# Altium project Christmas-2023_Soundboard.PrjPcb
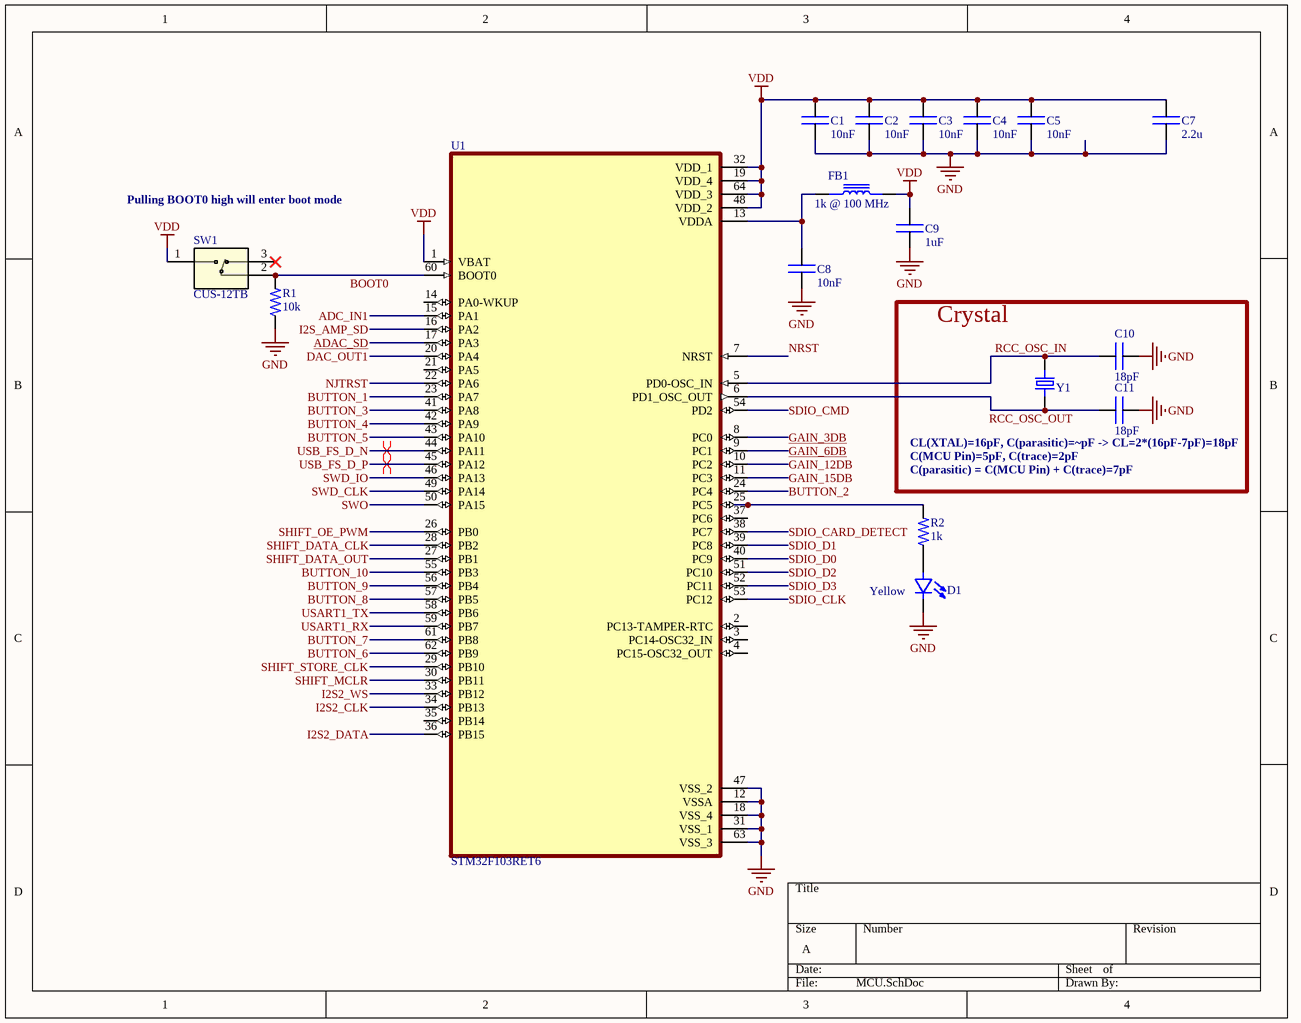
[diagram p0: MCU.SchDoc]
5 sheets, 208 parts. Net scope: global (net labels, ports and power ports of the same name join across sheets).
Board file: Christmas-2023_Soundboard.PcbDoc
Sheets:
  MCU.SchDoc
  Connectors-SD.SchDoc
  Amplifier.SchDoc
  PWR.SchDoc
  UI.SchDoc

## Sheet MCU.SchDoc
size A; SheetNumber: 1; SheetTotal: 5

### Parts
C1  value 10nF  [0603-CAP]  (hidden comment: CAP)
C2  value 10nF  [0603-CAP]  (hidden comment: CAP)
C3  value 10nF  [0603-CAP]  (hidden comment: CAP)
C4  value 10nF  [0603-CAP]  (hidden comment: CAP)
C5  value 10nF  [0603-CAP]  (hidden comment: CAP)
C7  value 2.2u  [0603-CAP]  (hidden comment: CAP)
C8  value 10nF  [0603-CAP]  (hidden comment: CAP)
C9  value 1uF  [0603-CAP]  (hidden comment: CAP)
C10  value 18pF  [0603-CAP]  (hidden comment: CAP)
C11  value 18pF  [0603-CAP]  (hidden comment: CAP)
D1  Color: Yellow  [0603-LED]  (hidden comment: LED - single)
FB1  1k @ 100 MHz  [0603-FB]
R1  value 10k  [0603-RES]  (hidden comment: RES)
R2  value 1k  [0603-RES]  (hidden comment: RES)
SW1  CUS-12TB  [SSSS811101]
U1  STM32F103RET6  [LQFP-64]
Y1  SX5B12.000F1620F30  [SMD5032-4P]  (value not drawn)

### Blocks framed on the sheet
Crystal: C10 C11 Y1

### Nets
GND: C1.1 C2.1 C3.1 C4.1 C5.1 C7.1 C8.1 C9.1 C10.2 C11.2 D1.2(C) R1.1 U1.12(VSSA) U1.18(VSS_4) U1.31(VSS_1) U1.47(VSS_2) U1.63(VSS_3)
VDD: C1.2 C2.2 C3.2 C4.2 C5.2 C7.2 C9.2 FB1.2 SW1.1 U1.1(VBAT) U1.19(VDD_4) U1.32(VDD_1) U1.48(VDD_2) U1.64(VDD_3)
ADAC_SD: U1.17(PA3)
ADC_IN1: U1.15(PA1)
BOOT0: R1.2 SW1.2 U1.60(BOOT0)
BUTTON_1: U1.23(PA7)
BUTTON_2: U1.24(PC4)
BUTTON_3: U1.41(PA8)
BUTTON_4: U1.42(PA9)
BUTTON_5: U1.43(PA10)
BUTTON_6: U1.62(PB9)
BUTTON_7: U1.61(PB8)
BUTTON_8: U1.57(PB5)
BUTTON_9: U1.56(PB4)
BUTTON_10: U1.55(PB3)
DAC_OUT1: U1.20(PA4)
GAIN_3DB: U1.8(PC0)
GAIN_6DB: U1.9(PC1)
GAIN_12DB: U1.10(PC2)
GAIN_15DB: U1.11(PC3)
I2S2_CLK: U1.34(PB13)
I2S2_DATA: U1.36(PB15)
I2S2_WS: U1.33(PB12)
I2S_AMP_SD: U1.16(PA2)
NJTRST: U1.22(PA6)
NRST: U1.7(NRST)
RCC_OSC_IN: C10.1 U1.5(PD0-OSC_IN) Y1.1
RCC_OSC_OUT: C11.1 U1.6(PD1_OSC_OUT) Y1.2
SDIO_CARD_DETECT: U1.38(PC7)
SDIO_CLK: U1.53(PC12)
SDIO_CMD: U1.54(PD2)
SDIO_D0: U1.40(PC9)
SDIO_D1: U1.39(PC8)
SDIO_D2: U1.51(PC10)
SDIO_D3: U1.52(PC11)
SHIFT_DATA_CLK: U1.28(PB2)
SHIFT_DATA_OUT: U1.27(PB1)
SHIFT_MCLR: U1.30(PB11)
SHIFT_OE_PWM: U1.26(PB0)
SHIFT_STORE_CLK: U1.29(PB10)
SWD_CLK: U1.49(PA14)
SWD_IO: U1.46(PA13)
SWO: U1.50(PA15)
USART1_RX: U1.59(PB7)
USART1_TX: U1.58(PB6)
USB_FS_D_N: U1.44(PA11)
USB_FS_D_P: U1.45(PA12)
NetC8_2: C8.2 FB1.1 U1.13(VDDA)
NetD1_1: D1.1(A) R2.1
NetR2_2: R2.2 U1.25(PC5)

Not connected (* = marked no-connect by the designer): SW1 3*; U1 2(PC13-TAMPER-RTC) 3(PC14-OSC32_IN) 4(PC15-OSC32_OUT) 14(PA0-WKUP) 21(PA5) 35(PB14) 37(PC6)

### Layout directives
differential pair; differential pair class DIFF_USB: USB_FS_D_N, USB_FS_D_P

### Notes on the sheet
- Pulling BOOT0 high will enter boot mode
- CL(XTAL)=16pF, C(parasitic)=~pF -> CL=2*(16pF-7pF)=18pF
- C(MCU Pin)=5pF, C(trace)=2pF
- C(parasitic) = C(MCU Pin) + C(trace)=7pF

### Library data of the parts
C1-C5 C7-C11 = CAP: Capaicitor; Type: SMD; MFR: *; MFR PN: *
D1 = LED - single: LED; MFR: MEIHUA; MFR PN: MHT192WDT-GOLD; Type: SMD
FB1 = FERRITE BEAD: MFR: TDK; MFR PN: MMZ1608Y102BTD25; Type: SMD
R1 R2 = RES: Resistor; MFR PN: *; MFR: *; Type: SMD
SW1 = SPDT SLIDE SWITCH: JLC Alternate: / SSSS811101; MFR: ALPSALPINE; MFR PN: SSSS811101; Type: SMD
U1 = STM32F103RET6: STM32F103RET6, 32 bit ARM Cortex M3 Microcontroller 72MHz 256 kB Flash, 48 kB RAM, USB CAN I2C 64-Pin LQFP; MFR: STMicroelectronics; MFR PN: STM32F103RET6; Type: SMD
Y1 = XTAL-OSC_JLC: SMD Tuning Fork Crystal; MFR: Shenzhen SCTF Elec; Frequency: 12MHz; MFR PN: SX5B12.000F1620F30; Type: SMD; JLC PN: C2901628

## Sheet Connectors-SD.SchDoc
size B; SheetNumber: 2; SheetTotal: 5
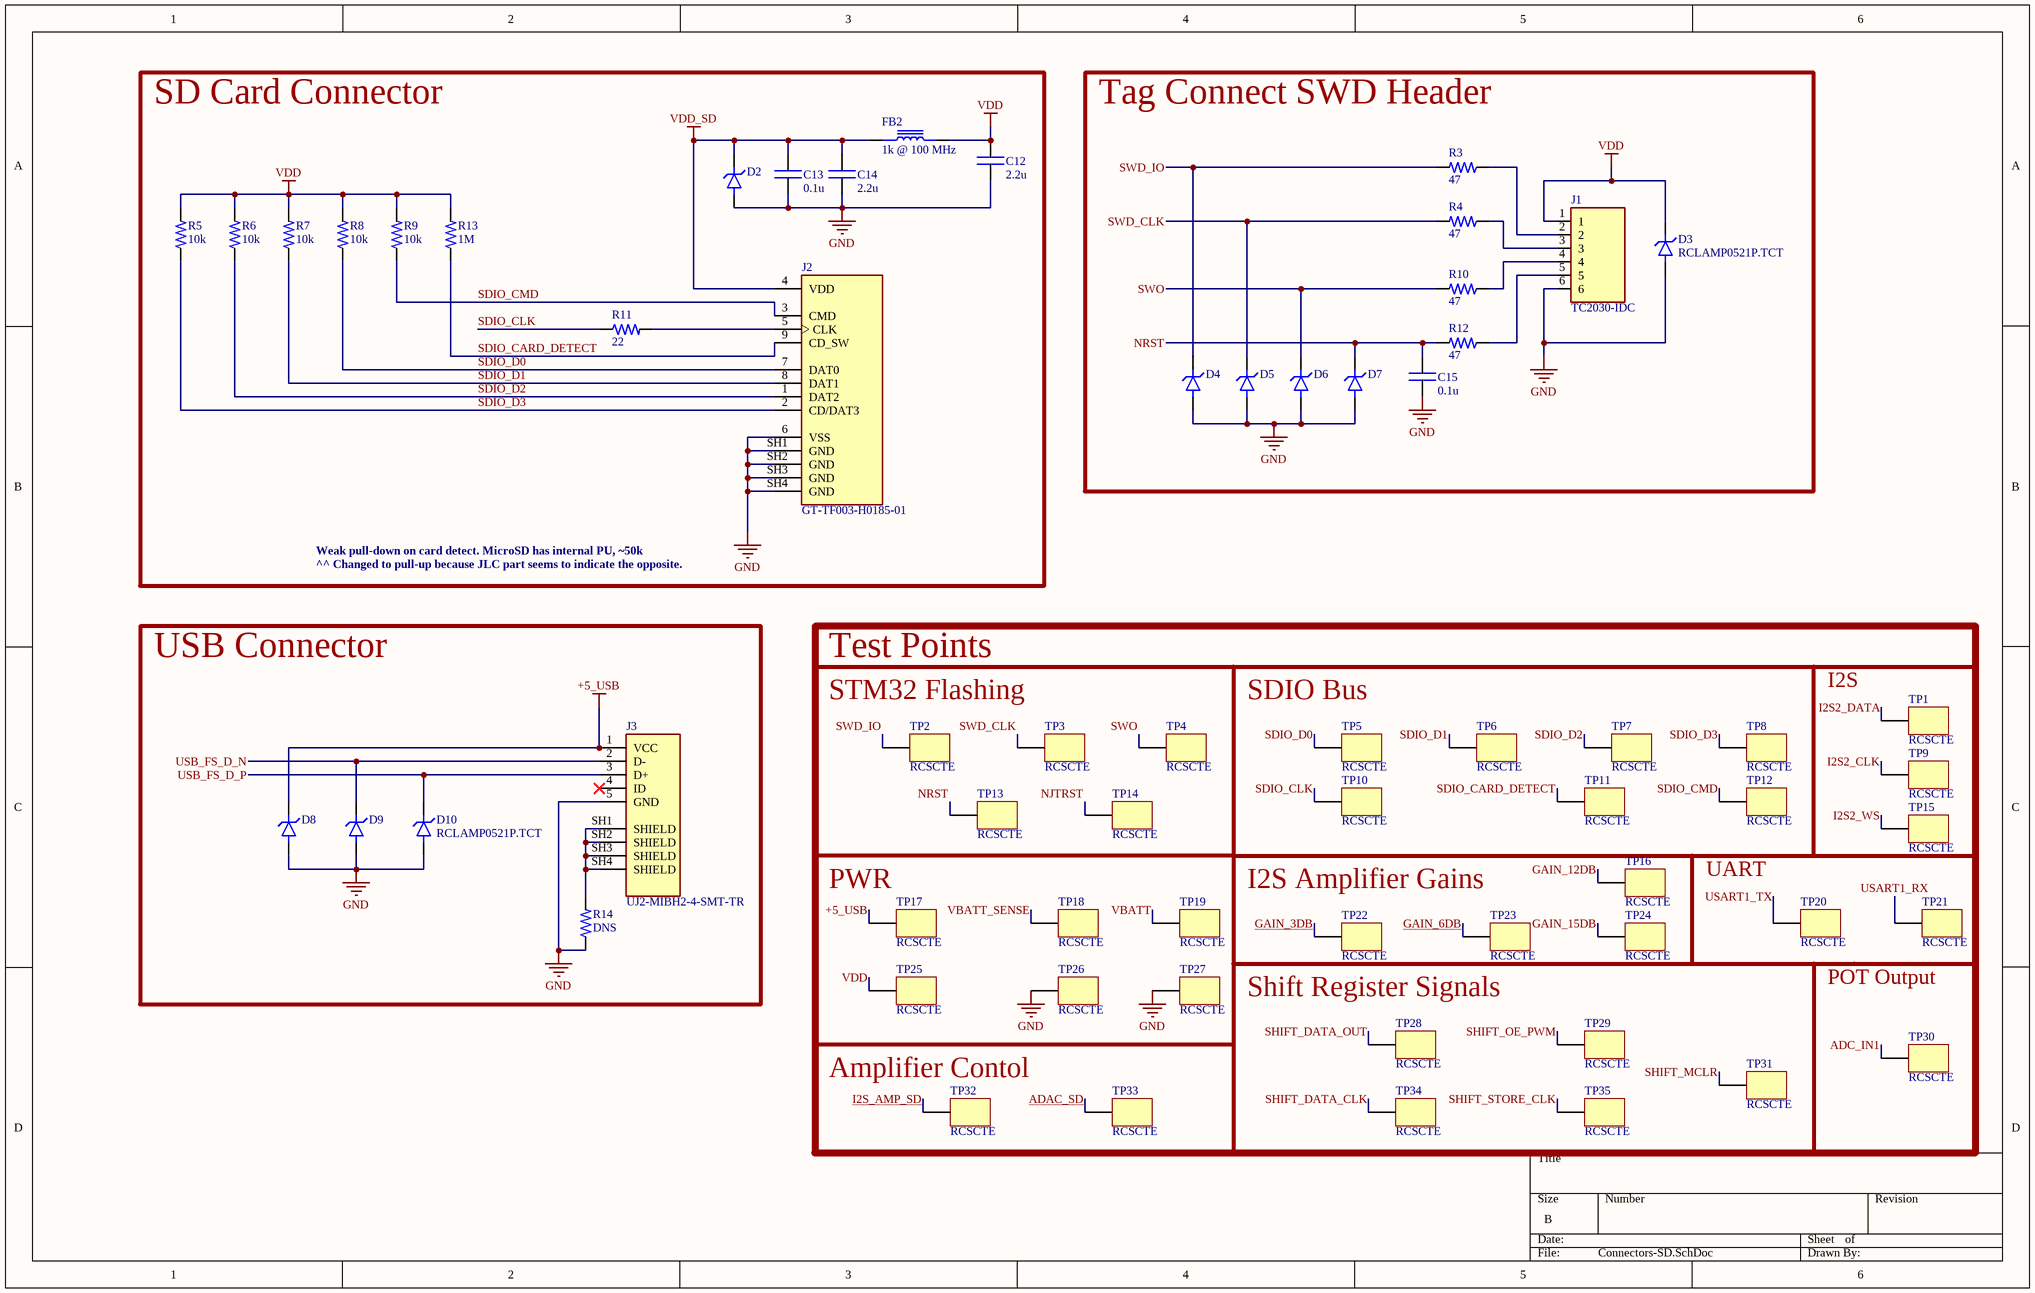
[diagram p1: Connectors-SD.SchDoc]

### Parts
C12  value 2.2u  [0603-CAP]  (hidden comment: CAP)
C13  value 0.1u  [0603-CAP]  (hidden comment: CAP)
C14  value 2.2u  [0603-CAP]  (hidden comment: CAP)
C15  value 0.1u  [0603-CAP]  (hidden comment: CAP)
D2  RCLAMP0521P.TCT  [RCLAMP0521P.TCT]  (value not drawn)
D3  RCLAMP0521P.TCT  [RCLAMP0521P.TCT]
D4  RCLAMP0521P.TCT  [RCLAMP0521P.TCT]  (value not drawn)
D5  RCLAMP0521P.TCT  [RCLAMP0521P.TCT]  (value not drawn)
D6  RCLAMP0521P.TCT  [RCLAMP0521P.TCT]  (value not drawn)
D7  RCLAMP0521P.TCT  [RCLAMP0521P.TCT]  (value not drawn)
D8  RCLAMP0521P.TCT  [RCLAMP0521P.TCT]  (value not drawn)
D9  RCLAMP0521P.TCT  [RCLAMP0521P.TCT]  (value not drawn)
D10  RCLAMP0521P.TCT  [RCLAMP0521P.TCT]
FB2  1k @ 100 MHz  [0603-FB]
J1  TC2030-IDC  [TAG CONNECT TC2030IDC - NO 3D MODEL]
J2  GT-TF003-H0185-01  [GTTF003H018501]
J3  UJ2-MIBH2-4-SMT-TR  [USB MICRO JLC]
R3  value 47  [0603-RES]  (hidden comment: RES)
R4  value 47  [0603-RES]  (hidden comment: RES)
R5  value 10k  [0603-RES]  (hidden comment: RES)
R6  value 10k  [0603-RES]  (hidden comment: RES)
R7  value 10k  [0603-RES]  (hidden comment: RES)
R8  value 10k  [0603-RES]  (hidden comment: RES)
R9  value 10k  [0603-RES]  (hidden comment: RES)
R10  value 47  [0603-RES]  (hidden comment: RES)
R11  value 22  [0603-RES]  (hidden comment: RES)
R12  value 47  [0603-RES]  (hidden comment: RES)
R13  value 1M  [0603-RES]  (hidden comment: RES)
R14  value DNS  [0603-RES]  (hidden comment: RES)
TP1  RCSCTE  [RCWCTE]
TP2  RCSCTE  [RCWCTE]
TP3  RCSCTE  [RCWCTE]
TP4  RCSCTE  [RCWCTE]
TP5  RCSCTE  [RCWCTE]
TP6  RCSCTE  [RCWCTE]
TP7  RCSCTE  [RCWCTE]
TP8  RCSCTE  [RCWCTE]
TP9  RCSCTE  [RCWCTE]
TP10  RCSCTE  [RCWCTE]
TP11  RCSCTE  [RCWCTE]
TP12  RCSCTE  [RCWCTE]
TP13  RCSCTE  [RCWCTE]
TP14  RCSCTE  [RCWCTE]
TP15  RCSCTE  [RCWCTE]
TP16  RCSCTE  [RCWCTE]
TP17  RCSCTE  [RCWCTE]
TP18  RCSCTE  [RCWCTE]
TP19  RCSCTE  [RCWCTE]
TP20  RCSCTE  [RCWCTE]
TP21  RCSCTE  [RCWCTE]
TP22  RCSCTE  [RCWCTE]
TP23  RCSCTE  [RCWCTE]
TP24  RCSCTE  [RCWCTE]
TP25  RCSCTE  [RCWCTE]
TP26  RCSCTE  [RCWCTE]
TP27  RCSCTE  [RCWCTE]
TP28  RCSCTE  [RCWCTE]
TP29  RCSCTE  [RCWCTE]
TP30  RCSCTE  [RCWCTE]
TP31  RCSCTE  [RCWCTE]
TP32  RCSCTE  [RCWCTE]
TP33  RCSCTE  [RCWCTE]
TP34  RCSCTE  [RCWCTE]
TP35  RCSCTE  [RCWCTE]

### Blocks framed on the sheet
SD Card Connector: C12-C14 D2 FB2 J2 R5-R9 R11 R13
Tag Connect SWD Header: C15 D3-D7 J1 R3 R4 R10 R12
USB Connector: D8-D10 J3 R14
Test Points: TP1-TP35

### Nets
+5_USB: D8.K J3.1(VCC) TP17.1
GND: C12.1 C13.1 C14.1 C15.1 D2.A D3.A D4.A D5.A D6.A D7.A D8.A D9.A D10.A J1.6 J2.6(VSS) J2.SH1(GND) J2.SH2(GND) J2.SH3(GND) J2.SH4(GND) J3.5(GND) R14.1 TP26.1 TP27.1
VBATT: TP19.1
VDD: C12.2 D3.K FB2.2 J1.1 R5.2 R6.2 R7.2 R8.2 R9.2 R13.2 TP25.1
VDD_SD: C13.2 C14.2 D2.K FB2.1 J2.4(VDD)
ADAC_SD: TP33.1
ADC_IN1: TP30.1
GAIN_3DB: TP22.1
GAIN_6DB: TP23.1
GAIN_12DB: TP16.1
GAIN_15DB: TP24.1
I2S2_CLK: TP9.1
I2S2_DATA: TP1.1
I2S2_WS: TP15.1
I2S_AMP_SD: TP32.1
NJTRST: TP14.1
NRST: C15.2 D7.K R12.2 TP13.1
SDIO_CARD_DETECT: J2.9(CD_SW) R13.1 TP11.1
SDIO_CLK: R11.1 TP10.1
SDIO_CMD: J2.3(CMD) R9.1 TP12.1
SDIO_D0: J2.7(DAT0) R8.1 TP5.1
SDIO_D1: J2.8(DAT1) R7.1 TP6.1
SDIO_D2: J2.1(DAT2) R6.1 TP7.1
SDIO_D3: J2.2(CD/DAT3) R5.1 TP8.1
SHIFT_DATA_CLK: TP34.1
SHIFT_DATA_OUT: TP28.1
SHIFT_MCLR: TP31.1
SHIFT_OE_PWM: TP29.1
SHIFT_STORE_CLK: TP35.1
SWD_CLK: D5.K R4.2 TP3.1
SWD_IO: D4.K R3.2 TP2.1
SWO: D6.K R10.2 TP4.1
USART1_RX: TP21.1
USART1_TX: TP20.1
USB_FS_D_N: D9.K J3.2(D-)
USB_FS_D_P: D10.K J3.3(D+)
VBATT_SENSE: TP18.1
NetJ1_2: J1.2 R3.1
NetJ1_3: J1.3 R4.1
NetJ1_4: J1.4 R10.1
NetJ1_5: J1.5 R12.1
NetJ2_5: J2.5(CLK) R11.2
NetJ3_SH1: J3.SH1(SHIELD) J3.SH2(SHIELD) J3.SH3(SHIELD) J3.SH4(SHIELD) R14.2

Not connected (* = marked no-connect by the designer): J3 4(ID)*

### Notes on the sheet
- Weak pull-down on card detect. MicroSD has internal PU, ~50k
- ^^ Changed to pull-up because JLC part seems to indicate the opposite.
- STM32 Flashing
- (near TP5) SDIO Bus
- I2S
- (near TP17) PWR
- I2S Amplifier Gains
- UART
- Shift Register Signals
- POT Output
- (near TP32) Amplifier Contol

### Library data of the parts
C12-C15 = CAP: Capaicitor; Type: SMD; MFR: *; MFR PN: *
D2-D10 = TVS DIODE: 25V Clamp 4A (8/20µs) Ipp Tvs Diode Surface Mount SLP1006P2; MFR: Semtech Corporation; Type: SMD; MFR PN: RCLAMP0521P.TCT
FB2 = FERRITE BEAD: as FB1 on sheet MCU
J1 = TAG CONNECT POGO HEADER: "Plug of Nails" POGO Pin connector; MFR: Tag-Connect; MFR PN: TC2030-IDC
J2 = SD-CONN-SMD_JLC: MFR: G-Switch; MFR PN: GT-TF003-H0185-01; Type: SMD
J3 = Micro USB Port: Micro B, USB 2.0, 1.8 A, Right Angle, Surface Mount (SMT), USB Receptacle; MFR: D-CHAIN; MFR PN: UA0507065250-037-06
R3-R14 = RES: Resistor; MFR PN: *; MFR: *; Type: SMD
TP1-TP35 = Test Point: Test Point, Surface Mount; MFR: KOA Speer Electronics, Inc.; MFR PN: RCSCTE; Type: SMD

## Sheet Amplifier.SchDoc
size A; SheetNumber: 3; SheetTotal: 5
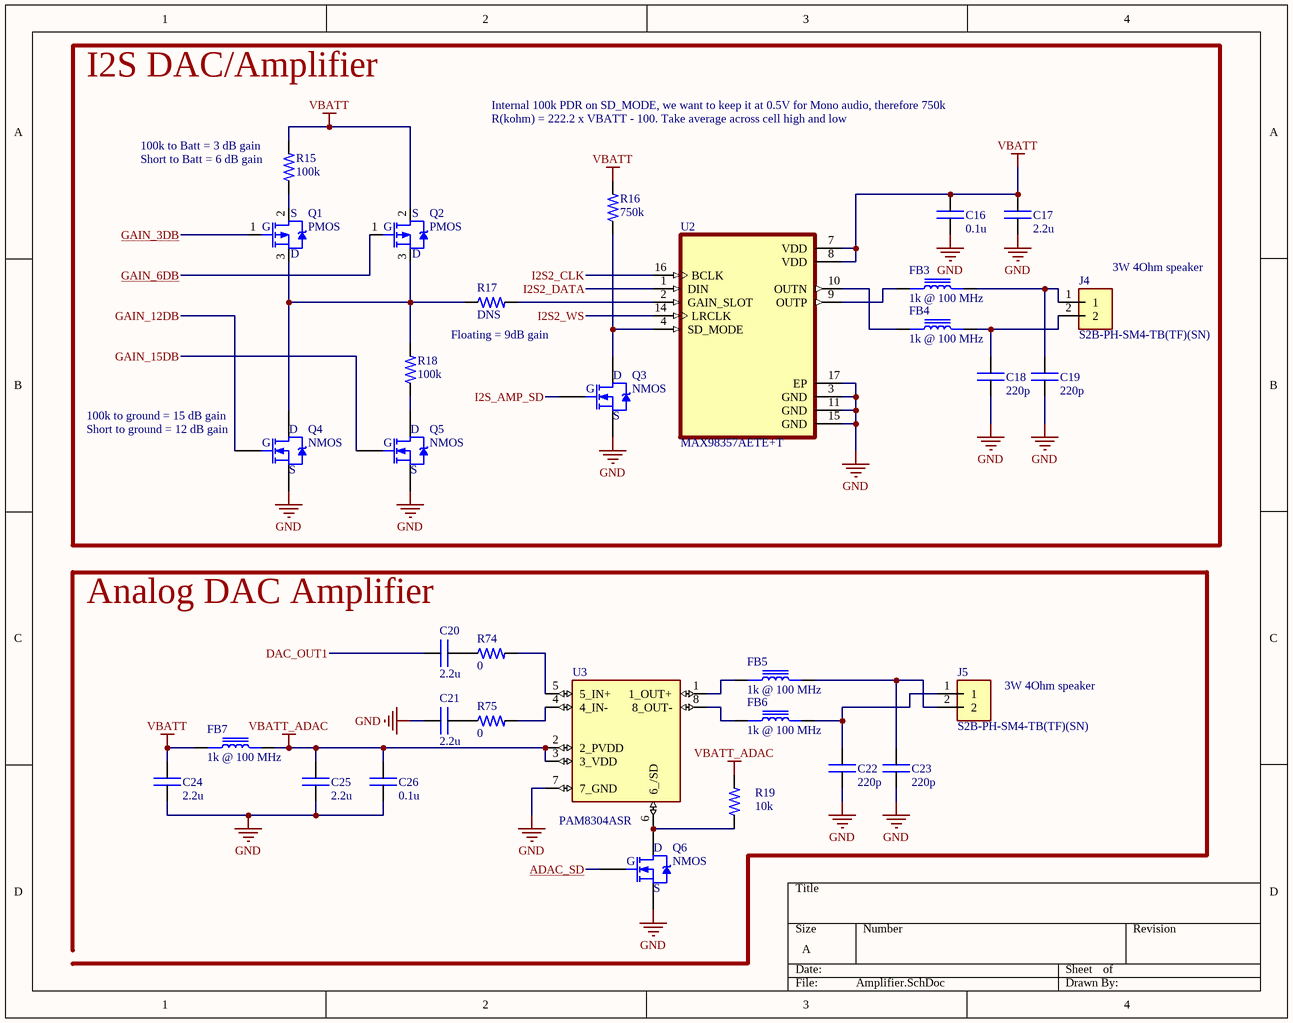
[diagram p2: Amplifier.SchDoc]

### Parts
C16  value 0.1u  [0603-CAP]  (hidden comment: CAP)
C17  value 2.2u  [0603-CAP]  (hidden comment: CAP)
C18  value 220p  [0603-CAP]  (hidden comment: CAP)
C19  value 220p  [0603-CAP]  (hidden comment: CAP)
C20  value 2.2u  [0603-CAP]  (hidden comment: CAP)
C21  value 2.2u  [0603-CAP]  (hidden comment: CAP)
C22  value 220p  [0603-CAP]  (hidden comment: CAP)
C23  value 220p  [0603-CAP]  (hidden comment: CAP)
C24  value 2.2u  [0603-CAP]  (hidden comment: CAP)
C25  value 2.2u  [0603-CAP]  (hidden comment: CAP)
C26  value 0.1u  [0603-CAP]  (hidden comment: CAP)
FB3  1k @ 100 MHz  [0603-FB]
FB4  1k @ 100 MHz  [0603-FB]
FB5  1k @ 100 MHz  [0603-FB]
FB6  1k @ 100 MHz  [0603-FB]
FB7  1k @ 100 MHz  [0603-FB]
J4  S2B-PH-SM4-TB(TF)(SN)  [JST_PH-2POS-SMT-RA]
J5  S2B-PH-SM4-TB(TF)(SN)  [JST_PH-2POS-SMT-RA]
Q1  PMOS  [SOT-23]
Q2  PMOS  [SOT-23]
Q3  NMOS  [SOT-23]
Q4  NMOS  [SOT-23]
Q5  NMOS  [SOT-23]
Q6  NMOS  [SOT-23]
R15  value 100k  [0603-RES]  (hidden comment: RES)
R16  value 750k  [0603-RES]  (hidden comment: RES)
R17  value DNS  [0603-RES]  (hidden comment: RES)
R18  value 100k  [0603-RES]  (hidden comment: RES)
R19  value 10k  [0603-RES]  (hidden comment: RES)
R74  value 0  [0603-RES]  (hidden comment: RES)
R75  value 0  [0603-RES]  (hidden comment: RES)
U2  MAX98357AETE+T  [16-WFQFN EXPOSED PAD]
U3  PAM8304ASR  [8-TSSOP]

### Blocks framed on the sheet
I2S DAC/Amplifier: C16-C19 FB3 FB4 J4 Q1-Q5 R15-R18 U2

### Nets
GND: C16.1 C17.1 C18.1 C19.1 C21.1 C22.1 C23.1 C24.1 C25.1 C26.1 Q3.2(S) Q4.2(S) Q5.2(S) Q6.2(S) U2.3(GND) U2.11(GND) U2.15(GND) U2.17(EP) U3.7(7_GND)
VBATT: C16.2 C17.2 C24.2 FB7.1 Q2.2(D) R15.2 R16.2 U2.7(VDD) U2.8(VDD)
VBATT_ADAC: C25.2 C26.2 FB7.2 R19.2 U3.2(2_PVDD) U3.3(3_VDD)
ADAC_SD: Q6.1(G)
DAC_OUT1: C20.1
GAIN_3DB: Q1.1(G)
GAIN_6DB: Q2.1(G)
GAIN_12DB: Q4.1(G)
GAIN_15DB: Q5.1(G)
I2S2_CLK: U2.16(BCLK)
I2S2_DATA: U2.1(DIN)
I2S2_WS: U2.14(LRCLK)
I2S_AMP_SD: Q3.1(G)
NetC18_2: C18.2 FB4.2 J4.2
NetC19_2: C19.2 FB3.2 J4.1
NetC20_2: C20.2 R74.1
NetC21_2: C21.2 R75.1
NetC22_2: C22.2 FB6.2 J5.1
NetC23_2: C23.2 FB5.2 J5.2
NetFB3_1: FB3.1 U2.9(OUTP)
NetFB4_1: FB4.1 U2.10(OUTN)
NetFB5_1: FB5.1 U3.1(1_OUT+)
NetFB6_1: FB6.1 U3.8(8_OUT-)
NetQ1_2: Q1.2(D) R15.1
NetQ1_3: Q1.3(S) Q2.3(S) Q4.3(D) R17.1 R18.2
NetQ3_3: Q3.3(D) R16.1 U2.4(SD_MODE)
NetQ5_3: Q5.3(D) R18.1
NetQ6_3: Q6.3(D) R19.1 U3.6(6_/SD)
NetR17_2: R17.2 U2.2(GAIN_SLOT)
NetR74_2: R74.2 U3.5(5_IN+)
NetR75_2: R75.2 U3.4(4_IN-)

### Notes on the sheet
- (near R15) 100k to Batt = 3 dB gain
- (near R15) Short to Batt = 6 dB gain
- Internal 100k PDR on SD_MODE, we want to keep it at 0.5V for Mono audio, therefore 750k
- R(kohm) = 222.2 x VBATT - 100. Take average across cell high and low
- (near J4) 3W 4Ohm speaker
- Floating = 9dB gain
- (near Q4) 100k to ground = 15 dB gain
- (near Q4) Short to ground = 12 dB gain
- Analog DAC Amplifier
- (near J5) 3W 4Ohm speaker

### Library data of the parts
C16-C26 = CAP: Capaicitor; Type: SMD; MFR: *; MFR PN: *
FB3-FB7 = FERRITE BEAD: as FB1 on sheet MCU
J4 J5 = JST CONN 2POS PH: Connector Header Surface Mount, Right Angle 2 position 0.079 (2.00mm); MFR: JST Sales; MFR PN: S2B-PH-SM4-TB(TF)(SN); Type: SMD
Q1 Q2 = PMOS: P-Channel MOSFET; MFR PN: BSS84-7-F; MFR: Diodes Incorporated; Type: SMD
Q3-Q6 = NMOS: N-Channel MOSFET; MFR PN: DMN63D8L; MFR: Diodes Incorporated; Type: SMD
R15-R19 R74 R75 = RES: Resistor; MFR PN: *; MFR: *; Type: SMD
U2 = MAX98357AETE+T: I2S Audio DAC and amp; MFR: Analog Devices; MFR PN: MAX98357AETE+T; Type: SMD
U3 = AMP 3W ANALOG: Amplifier IC 1-Channel (Mono) Class D 8L-MSOP; MFR: Diodes Inc.; MFR PN: PAM8304ASR; Type: SMD

## Sheet PWR.SchDoc
size A; SheetNumber: 4; SheetTotal: 5
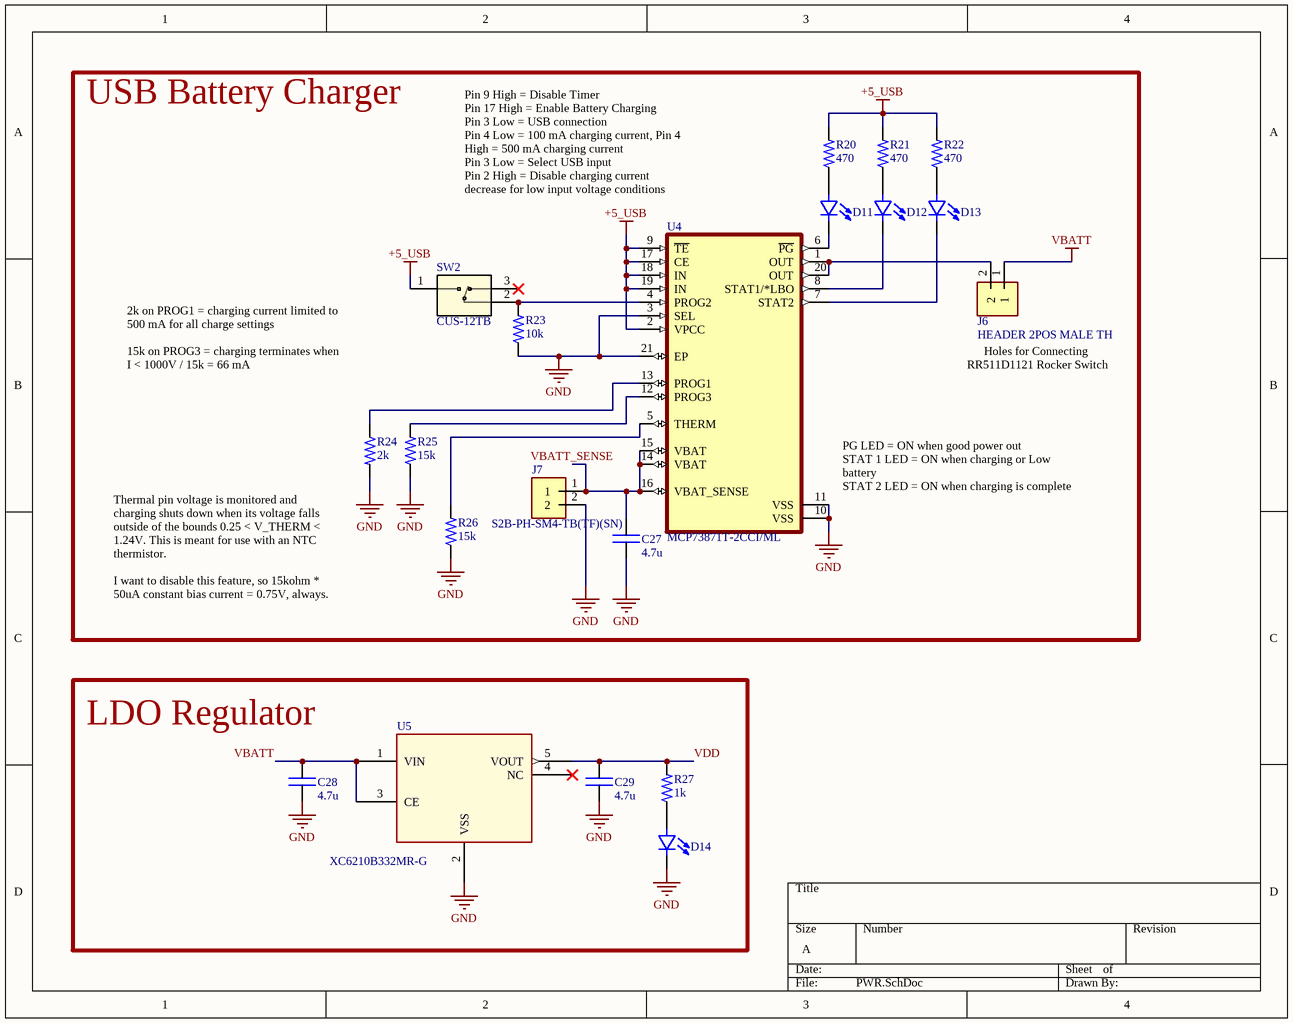
[diagram p3: PWR.SchDoc]

### Parts
C27  value 4.7u  [0603-CAP]  (hidden comment: CAP)
C28  value 4.7u  [0603-CAP]  (hidden comment: CAP)
C29  value 4.7u  [0603-CAP]  (hidden comment: CAP)
D11  LED - single  [0603-LED]  (value not drawn)
D12  LED - single  [0603-LED]  (value not drawn)
D13  LED - single  [0603-LED]  (value not drawn)
D14  LED - single  [0603-LED]  (value not drawn)
J6  HEADER 2POS MALE TH  [2-pos, 0.1" TH header]
J7  S2B-PH-SM4-TB(TF)(SN)  [JST_PH-2POS-SMT-RA]
R20  value 470  [0603-RES]  (hidden comment: RES)
R21  value 470  [0603-RES]  (hidden comment: RES)
R22  value 470  [0603-RES]  (hidden comment: RES)
R23  value 10k  [0603-RES]  (hidden comment: RES)
R24  value 2k  [0603-RES]  (hidden comment: RES)
R25  value 15k  [0603-RES]  (hidden comment: RES)
R26  value 15k  [0603-RES]  (hidden comment: RES)
R27  value 1k  [0603-RES]  (hidden comment: RES)
SW2  CUS-12TB  [SSSS811101]
U4  MCP73871T-2CCI/ML  [20-VFQFN EXPOSED PAD]
U5  XC6210B332MR-G  [SOT-25-5]

### Blocks framed on the sheet
USB Battery Charger: C27 D11-D13 J6 J7 R20-R26 SW2 U4
LDO Regulator: C28 C29 D14 R27 U5

### Nets
+5_USB: R20.2 R21.2 R22.2 SW2.1 U4.2(VPCC) U4.9(~{TE}) U4.17(CE) U4.18(IN) U4.19(IN)
GND: C27.2 C28.1 C29.2 D14.2(C) J7.2 R23.1 R24.2 R25.1 R26.1 U4.3(SEL) U4.10(VSS) U4.11(VSS) U4.21(EP) U5.2(VSS)
VBATT: C28.2 J6.1 U5.1(VIN) U5.3(CE)
VDD: C29.1 R27.2 U5.5(VOUT)
VBATT_SENSE: C27.1 J7.1 U4.14(VBAT) U4.15(VBAT) U4.16(VBAT_SENSE)
NetD11_1: D11.1(A) R20.1
NetD11_2: D11.2(C) U4.6(~{PG})
NetD12_1: D12.1(A) R21.1
NetD12_2: D12.2(C) U4.8(STAT1/*LBO)
NetD13_1: D13.1(A) R22.1
NetD13_2: D13.2(C) U4.7(STAT2)
NetD14_1: D14.1(A) R27.1
NetJ6_2: J6.2 U4.1(OUT) U4.20(OUT)
NetR23_2: R23.2 SW2.2 U4.4(PROG2)
NetR24_1: R24.1 U4.13(PROG1)
NetR25_2: R25.2 U4.12(PROG3)
NetR26_2: R26.2 U4.5(THERM)

Not connected (* = marked no-connect by the designer): SW2 3*; U5 4(NC)*

### Notes on the sheet
- Pin 9 High = Disable Timer
  Pin 17 High = Enable Battery Charging
  Pin 3 Low = USB connection
  Pin 4 Low = 100 mA charging current, Pin 4 High = 500 mA charging current
  Pin 3 Low = Select USB input
  Pin 2 High = Disable charging current decrease for low input voltage conditions
- 2k on PROG1 = charging current limited to 500 mA for all charge settings
  15k on PROG3 = charging terminates when I < 1000V / 15k = 66 mA
- Holes for Connecting
  RR511D1121 Rocker Switch
- (near U4) PG LED = ON when good power out
  STAT 1 LED = ON when charging or Low battery
  STAT 2 LED = ON when charging is complete
- (near R24) Thermal pin voltage is monitored and charging shuts down when its voltage falls outside of the bounds 0.25 < V_THERM < 1.24V. This is meant for use with an NTC thermistor.
  I want to disable this feature, so 15kohm * 50uA constant bias current = 0.75V, always.

### Library data of the parts
C27-C29 = CAP: Capaicitor; Type: SMD; MFR: *; MFR PN: *
D11 = LED - single: LED; MFR: MEIHUA; MFR PN: MHT192WDT-GOLD; Color: Yellow; Type: SMD
D12 = LED - single: LED; MFR: Hubei KENTO Elec; MFR PN: KT-0603R; Color: Red; Type: SMD
D13 D14 = LED - single: LED; MFR: Everlight Elec; MFR PN: 19-217/GHC-YR1S2/3T; Color: Green; Type: SMD
J6 = HEADER 2POS MALE TH: Value: DNS
J7 = JST CONN 2POS PH: as J4 on sheet Amplifier; MFR PN: S2B-PH-SM4-TB(TF)(SN); Type: SMD
R20-R27 = RES: Resistor; MFR PN: *; MFR: *; Type: SMD
SW2 = SPDT SLIDE SWITCH: as SW1 on sheet MCU; MFR PN: SSSS811101; Type: SMD
U4 = LiPo Batt Charger - Shared load: Charger IC Lithium Ion/Polymer 20-QFN (4x4); MFR: Microchip Technology; Type: SMD; MFR PN: MCP73871T-2CCI/ML
U5 = LDO 3.3V FIXED 700mA: No Description Available; MFR: Torex Semiconductor; MFR PN: XC6210B332MR-G; Type: SMD

## Sheet UI.SchDoc
size C; SheetNumber: 5; SheetTotal: 5
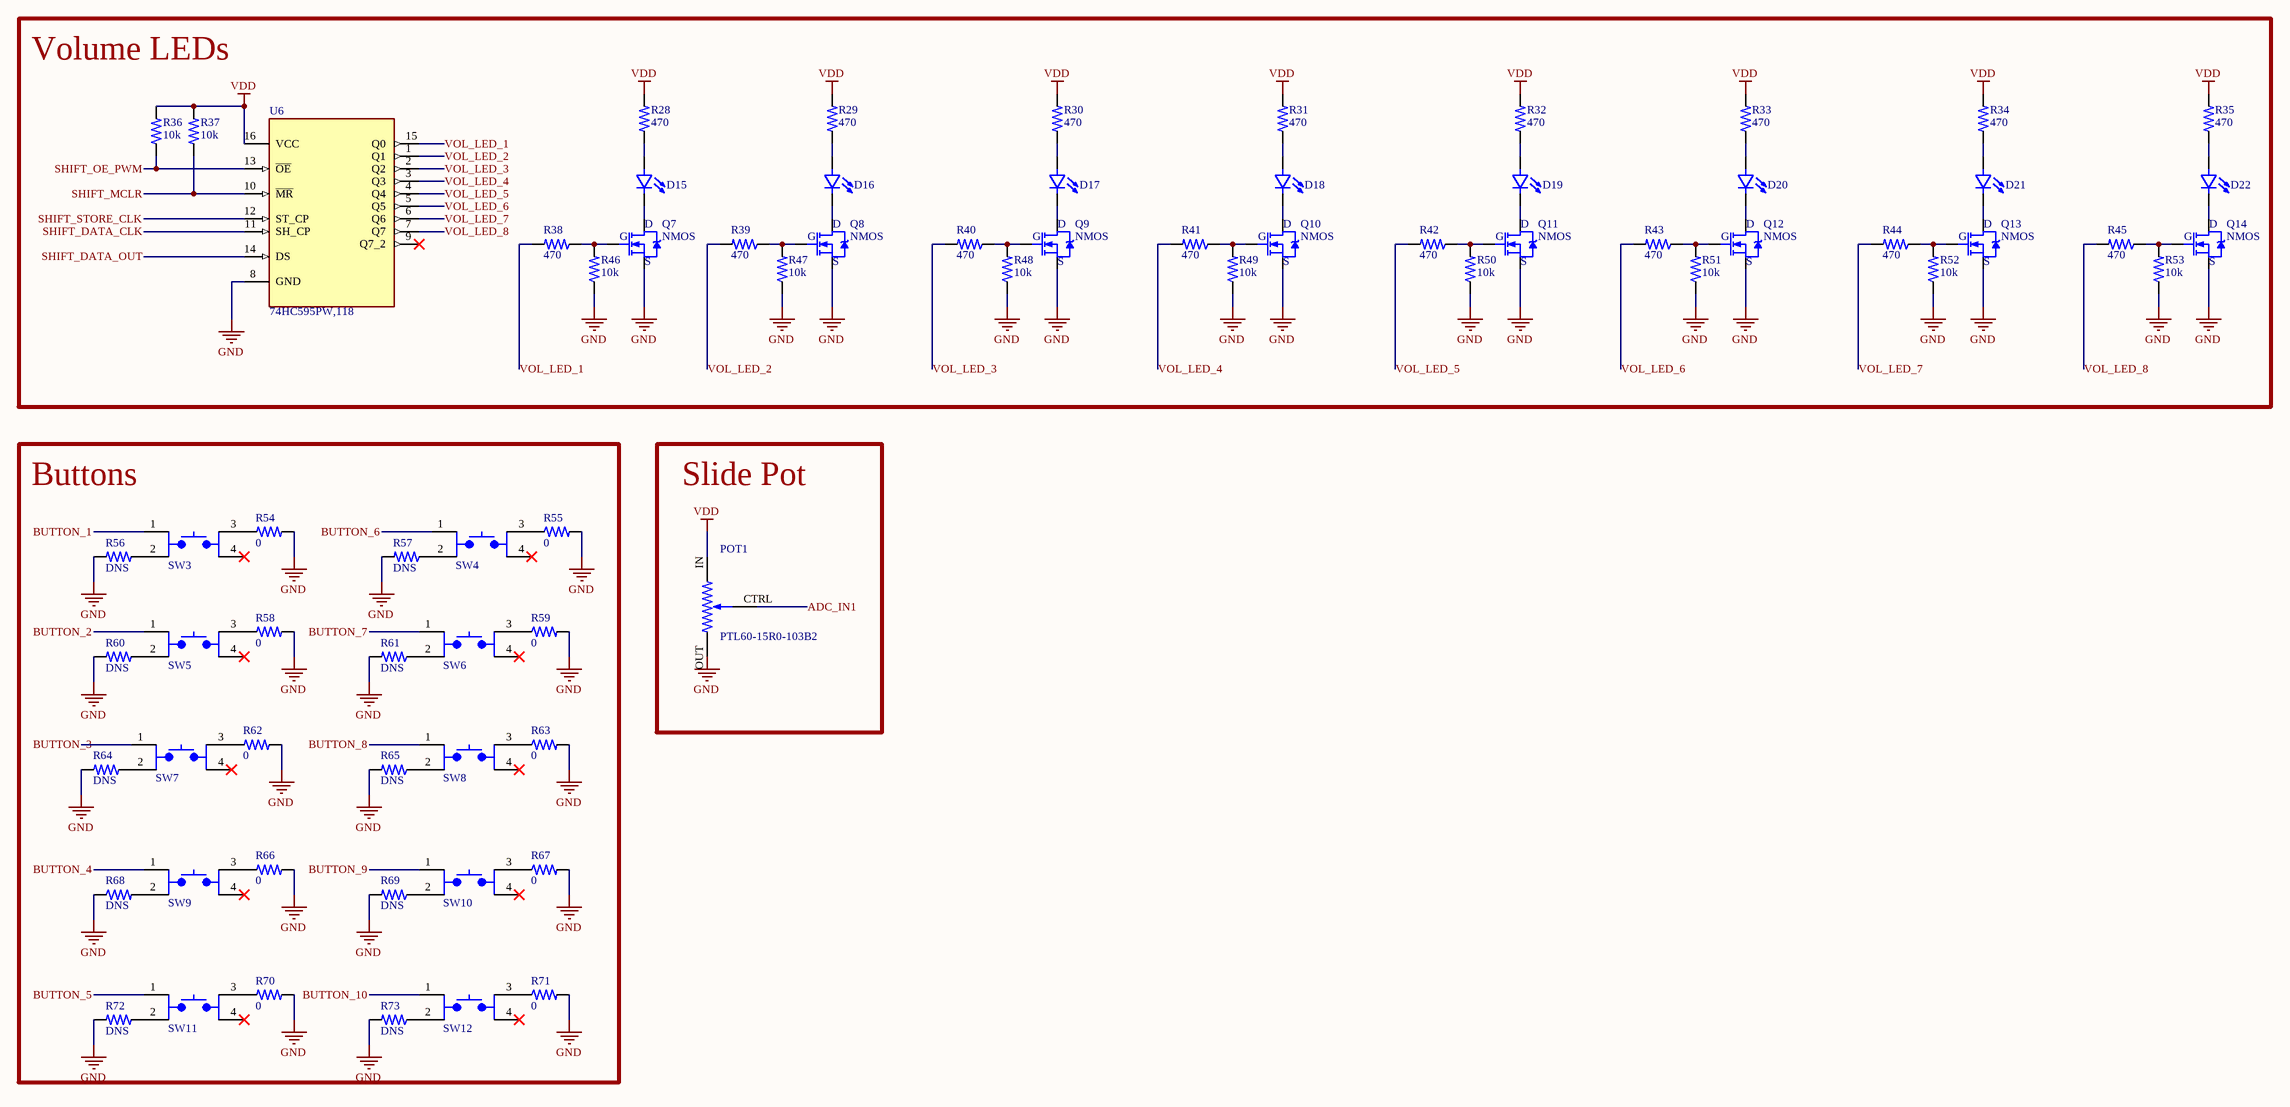
[diagram p4: UI.SchDoc]

### Parts
D15  LED - single  [0603-LED]  (value not drawn)
D16  LED - single  [0603-LED]  (value not drawn)
D17  LED - single  [0603-LED]  (value not drawn)
D18  LED - single  [0603-LED]  (value not drawn)
D19  LED - single  [0603-LED]  (value not drawn)
D20  LED - single  [0603-LED]  (value not drawn)
D21  LED - single  [0603-LED]  (value not drawn)
D22  LED - single  [0603-LED]  (value not drawn)
POT1  PTL60-15R0-103B2  [BIG SLIDE POT]
Q7  NMOS  [SOT-23]
Q8  NMOS  [SOT-23]
Q9  NMOS  [SOT-23]
Q10  NMOS  [SOT-23]
Q11  NMOS  [SOT-23]
Q12  NMOS  [SOT-23]
Q13  NMOS  [SOT-23]
Q14  NMOS  [SOT-23]
R28  value 470  [0603-RES]  (hidden comment: RES)
R29  value 470  [0603-RES]  (hidden comment: RES)
R30  value 470  [0603-RES]  (hidden comment: RES)
R31  value 470  [0603-RES]  (hidden comment: RES)
R32  value 470  [0603-RES]  (hidden comment: RES)
R33  value 470  [0603-RES]  (hidden comment: RES)
R34  value 470  [0603-RES]  (hidden comment: RES)
R35  value 470  [0603-RES]  (hidden comment: RES)
R36  value 10k  [0603-RES]  (hidden comment: RES)
R37  value 10k  [0603-RES]  (hidden comment: RES)
R38  value 470  [0603-RES]  (hidden comment: RES)
R39  value 470  [0603-RES]  (hidden comment: RES)
R40  value 470  [0603-RES]  (hidden comment: RES)
R41  value 470  [0603-RES]  (hidden comment: RES)
R42  value 470  [0603-RES]  (hidden comment: RES)
R43  value 470  [0603-RES]  (hidden comment: RES)
R44  value 470  [0603-RES]  (hidden comment: RES)
R45  value 470  [0603-RES]  (hidden comment: RES)
R46  value 10k  [0603-RES]  (hidden comment: RES)
R47  value 10k  [0603-RES]  (hidden comment: RES)
R48  value 10k  [0603-RES]  (hidden comment: RES)
R49  value 10k  [0603-RES]  (hidden comment: RES)
R50  value 10k  [0603-RES]  (hidden comment: RES)
R51  value 10k  [0603-RES]  (hidden comment: RES)
R52  value 10k  [0603-RES]  (hidden comment: RES)
R53  value 10k  [0603-RES]  (hidden comment: RES)
R54  value 0  [0603-RES]  (hidden comment: RES)
R55  value 0  [0603-RES]  (hidden comment: RES)
R56  value DNS  [0603-RES]  (hidden comment: RES)
R57  value DNS  [0603-RES]  (hidden comment: RES)
R58  value 0  [0603-RES]  (hidden comment: RES)
R59  value 0  [0603-RES]  (hidden comment: RES)
R60  value DNS  [0603-RES]  (hidden comment: RES)
R61  value DNS  [0603-RES]  (hidden comment: RES)
R62  value 0  [0603-RES]  (hidden comment: RES)
R63  value 0  [0603-RES]  (hidden comment: RES)
R64  value DNS  [0603-RES]  (hidden comment: RES)
R65  value DNS  [0603-RES]  (hidden comment: RES)
R66  value 0  [0603-RES]  (hidden comment: RES)
R67  value 0  [0603-RES]  (hidden comment: RES)
R68  value DNS  [0603-RES]  (hidden comment: RES)
R69  value DNS  [0603-RES]  (hidden comment: RES)
R70  value 0  [0603-RES]  (hidden comment: RES)
R71  value 0  [0603-RES]  (hidden comment: RES)
R72  value DNS  [0603-RES]  (hidden comment: RES)
R73  value DNS  [0603-RES]  (hidden comment: RES)
SW3  SPDT SMT Tactile Push Button Switch  [TACTILE SWITCH]  (value not drawn)
SW4  SPDT SMT Tactile Push Button Switch  [TACTILE SWITCH]  (value not drawn)
SW5  SPDT SMT Tactile Push Button Switch  [TACTILE SWITCH]  (value not drawn)
SW6  SPDT SMT Tactile Push Button Switch  [TACTILE SWITCH]  (value not drawn)
SW7  SPDT SMT Tactile Push Button Switch  [TACTILE SWITCH]  (value not drawn)
SW8  SPDT SMT Tactile Push Button Switch  [TACTILE SWITCH]  (value not drawn)
SW9  SPDT SMT Tactile Push Button Switch  [TACTILE SWITCH]  (value not drawn)
SW10  SPDT SMT Tactile Push Button Switch  [TACTILE SWITCH]  (value not drawn)
SW11  SPDT SMT Tactile Push Button Switch  [TACTILE SWITCH]  (value not drawn)
SW12  SPDT SMT Tactile Push Button Switch  [TACTILE SWITCH]  (value not drawn)
U6  74HC595PW,118  [16-TSSOP]

### Blocks framed on the sheet
Volume LEDs: D15-D22 Q7-Q14 R28-R53 U6
Buttons: R54-R73 SW3-SW12
Slide Pot: POT1

### Nets
GND: POT1.OUT(FINAL) Q7.2(S) Q8.2(S) Q9.2(S) Q10.2(S) Q11.2(S) Q12.2(S) Q13.2(S) Q14.2(S) R46.1 R47.1 R48.1 R49.1 R50.1 R51.1 R52.1 R53.1 R54.2 R55.2 R56.2 R57.2 R58.2 R59.2 R60.2 R61.2 R62.2 R63.2 R64.2 R65.2 R66.2 R67.2 R68.1 R69.2 R70.2 R71.2 R72.2 R73.2 U6.8(GND)
VDD: POT1.IN(INITIAL) R28.2 R29.2 R30.2 R31.2 R32.2 R33.2 R34.2 R35.2 R36.2 R37.2 U6.16(VCC)
ADC_IN1: POT1.CTRL(WIPER)
BUTTON_1: SW3.1
BUTTON_2: SW5.1
BUTTON_3: SW7.1
BUTTON_4: SW9.1
BUTTON_5: SW11.1
BUTTON_6: SW4.1
BUTTON_7: SW6.1
BUTTON_8: SW8.1
BUTTON_9: SW10.1
BUTTON_10: SW12.1
SHIFT_DATA_CLK: U6.11(SH_CP)
SHIFT_DATA_OUT: U6.14(DS)
SHIFT_MCLR: R37.1 U6.10(~{MR})
SHIFT_OE_PWM: R36.1 U6.13(~{OE})
SHIFT_STORE_CLK: U6.12(ST_CP)
VOL_LED_1: R38.2 U6.15(Q0)
VOL_LED_2: R39.2 U6.1(Q1)
VOL_LED_3: R40.2 U6.2(Q2)
VOL_LED_4: R41.2 U6.3(Q3)
VOL_LED_5: R42.2 U6.4(Q4)
VOL_LED_6: R43.2 U6.5(Q5)
VOL_LED_7: R44.2 U6.6(Q6)
VOL_LED_8: R45.2 U6.7(Q7)
NetD15_1: D15.1(A) R28.1
NetD15_2: D15.2(C) Q7.3(D)
NetD16_1: D16.1(A) R29.1
NetD16_2: D16.2(C) Q8.3(D)
NetD17_1: D17.1(A) R30.1
NetD17_2: D17.2(C) Q9.3(D)
NetD18_1: D18.1(A) R31.1
NetD18_2: D18.2(C) Q10.3(D)
NetD19_1: D19.1(A) R32.1
NetD19_2: D19.2(C) Q11.3(D)
NetD20_1: D20.1(A) R33.1
NetD20_2: D20.2(C) Q12.3(D)
NetD21_1: D21.1(A) R34.1
NetD21_2: D21.2(C) Q13.3(D)
NetD22_1: D22.1(A) R35.1
NetD22_2: D22.2(C) Q14.3(D)
NetQ7_1: Q7.1(G) R38.1 R46.2
NetQ8_1: Q8.1(G) R39.1 R47.2
NetQ9_1: Q9.1(G) R40.1 R48.2
NetQ10_1: Q10.1(G) R41.1 R49.2
NetQ11_1: Q11.1(G) R42.1 R50.2
NetQ12_1: Q12.1(G) R43.1 R51.2
NetQ13_1: Q13.1(G) R44.1 R52.2
NetQ14_1: Q14.1(G) R45.1 R53.2
NetR54_1: R54.1 SW3.3
NetR55_1: R55.1 SW4.3
NetR56_1: R56.1 SW3.2
NetR57_1: R57.1 SW4.2
NetR58_1: R58.1 SW5.3
NetR59_1: R59.1 SW6.3
NetR60_1: R60.1 SW5.2
NetR61_1: R61.1 SW6.2
NetR62_1: R62.1 SW7.3
NetR63_1: R63.1 SW8.3
NetR64_1: R64.1 SW7.2
NetR65_1: R65.1 SW8.2
NetR66_1: R66.1 SW9.3
NetR67_1: R67.1 SW10.3
NetR68_2: R68.2 SW9.2
NetR69_1: R69.1 SW10.2
NetR70_1: R70.1 SW11.3
NetR71_1: R71.1 SW12.3
NetR72_1: R72.1 SW11.2
NetR73_1: R73.1 SW12.2

Not connected (* = marked no-connect by the designer): SW3 4*; SW4 4*; SW5 4*; SW6 4*; SW7 4*; SW8 4*; SW9 4*; SW10 4*; SW11 4*; SW12 4*; U6 9(Q7_2)*

### Library data of the parts
D15 D17 D19 D21 = LED - single: as D13 on sheet PWR
D16 D18 D20 D22 = LED - single: as D12 on sheet PWR
POT1 = POT: POT 470 OHM 1/10W CARBON LINEAR; MFR: Bourns Inc.; Value: 10k; MFR PN: PTL60-15R0-103B2
Q7-Q14 = NMOS: as Q3 on sheet Amplifier
R28-R73 = RES: Resistor; MFR PN: *; MFR: *; Type: SMD
SW3-SW12 = SPDT SMT Tactile Push Button Switch: MFR: TE Connectivity ALCOSWITCH Switches; MFR PN: FSM8JSMASTR; Type: SMD
U6 = SHIFT REGISTER 8 BIT: Shift Shift Register 1 Element 8 Bit 16-TSSOP; MFR: Nexperia USA Inc.; MFR PN: 74HC595PW,118; Type: SMD

## Nets that join several sheets
+5_USB: Connectors-SD (D8.K J3.1 TP17.1), PWR (9 pins)
GND: MCU (17 pins), Connectors-SD (23 pins), Amplifier (19 pins), PWR (14 pins), UI (38 pins)
VBATT: Connectors-SD (TP19.1), Amplifier (9 pins), PWR (C28.2 J6.1 U5.1 U5.3)
VDD: MCU (14 pins), Connectors-SD (11 pins), PWR (C29.1 R27.2 U5.5), UI (12 pins)
ADAC_SD: MCU (U1.17), Connectors-SD (TP33.1), Amplifier (Q6.1)
ADC_IN1: MCU (U1.15), Connectors-SD (TP30.1), UI (POT1.CTRL)
BUTTON_1: MCU (U1.23), UI (SW3.1)
BUTTON_2: MCU (U1.24), UI (SW5.1)
BUTTON_3: MCU (U1.41), UI (SW7.1)
BUTTON_4: MCU (U1.42), UI (SW9.1)
BUTTON_5: MCU (U1.43), UI (SW11.1)
BUTTON_6: MCU (U1.62), UI (SW4.1)
BUTTON_7: MCU (U1.61), UI (SW6.1)
BUTTON_8: MCU (U1.57), UI (SW8.1)
BUTTON_9: MCU (U1.56), UI (SW10.1)
BUTTON_10: MCU (U1.55), UI (SW12.1)
DAC_OUT1: MCU (U1.20), Amplifier (C20.1)
GAIN_3DB: MCU (U1.8), Connectors-SD (TP22.1), Amplifier (Q1.1)
GAIN_6DB: MCU (U1.9), Connectors-SD (TP23.1), Amplifier (Q2.1)
GAIN_12DB: MCU (U1.10), Connectors-SD (TP16.1), Amplifier (Q4.1)
GAIN_15DB: MCU (U1.11), Connectors-SD (TP24.1), Amplifier (Q5.1)
I2S2_CLK: MCU (U1.34), Connectors-SD (TP9.1), Amplifier (U2.16)
I2S2_DATA: MCU (U1.36), Connectors-SD (TP1.1), Amplifier (U2.1)
I2S2_WS: MCU (U1.33), Connectors-SD (TP15.1), Amplifier (U2.14)
I2S_AMP_SD: MCU (U1.16), Connectors-SD (TP32.1), Amplifier (Q3.1)
NJTRST: MCU (U1.22), Connectors-SD (TP14.1)
NRST: MCU (U1.7), Connectors-SD (C15.2 D7.K R12.2 TP13.1)
SDIO_CARD_DETECT: MCU (U1.38), Connectors-SD (J2.9 R13.1 TP11.1)
SDIO_CLK: MCU (U1.53), Connectors-SD (R11.1 TP10.1)
SDIO_CMD: MCU (U1.54), Connectors-SD (J2.3 R9.1 TP12.1)
SDIO_D0: MCU (U1.40), Connectors-SD (J2.7 R8.1 TP5.1)
SDIO_D1: MCU (U1.39), Connectors-SD (J2.8 R7.1 TP6.1)
SDIO_D2: MCU (U1.51), Connectors-SD (J2.1 R6.1 TP7.1)
SDIO_D3: MCU (U1.52), Connectors-SD (J2.2 R5.1 TP8.1)
SHIFT_DATA_CLK: MCU (U1.28), Connectors-SD (TP34.1), UI (U6.11)
SHIFT_DATA_OUT: MCU (U1.27), Connectors-SD (TP28.1), UI (U6.14)
SHIFT_MCLR: MCU (U1.30), Connectors-SD (TP31.1), UI (R37.1 U6.10)
SHIFT_OE_PWM: MCU (U1.26), Connectors-SD (TP29.1), UI (R36.1 U6.13)
SHIFT_STORE_CLK: MCU (U1.29), Connectors-SD (TP35.1), UI (U6.12)
SWD_CLK: MCU (U1.49), Connectors-SD (D5.K R4.2 TP3.1)
SWD_IO: MCU (U1.46), Connectors-SD (D4.K R3.2 TP2.1)
SWO: MCU (U1.50), Connectors-SD (D6.K R10.2 TP4.1)
USART1_RX: MCU (U1.59), Connectors-SD (TP21.1)
USART1_TX: MCU (U1.58), Connectors-SD (TP20.1)
USB_FS_D_N: MCU (U1.44), Connectors-SD (D9.K J3.2)
USB_FS_D_P: MCU (U1.45), Connectors-SD (D10.K J3.3)
VBATT_SENSE: Connectors-SD (TP18.1), PWR (5 pins)